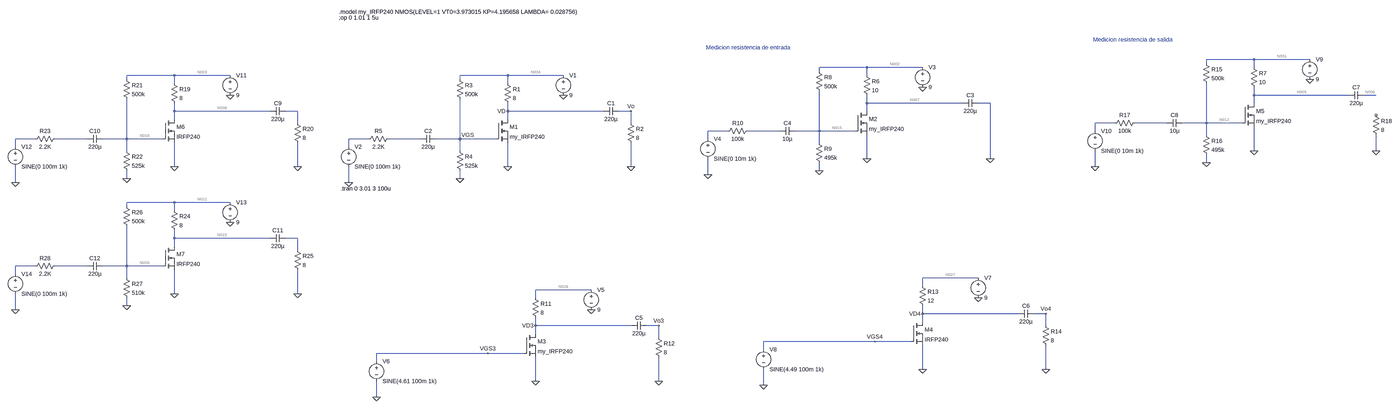
[diagram p0: schematic pruebas_amps.asc, whole sheet]
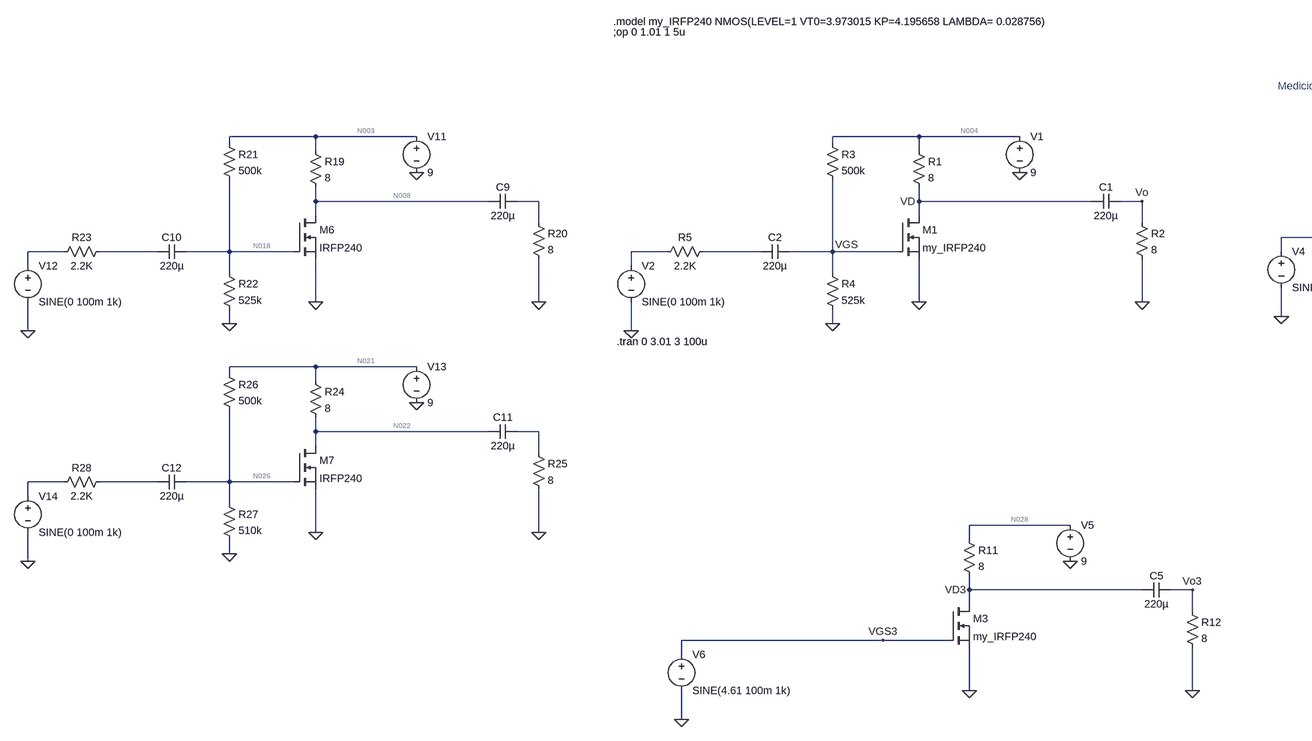
[diagram p1: schematic pruebas_amps.asc, part, row 1 of 1, column 1 of 2]
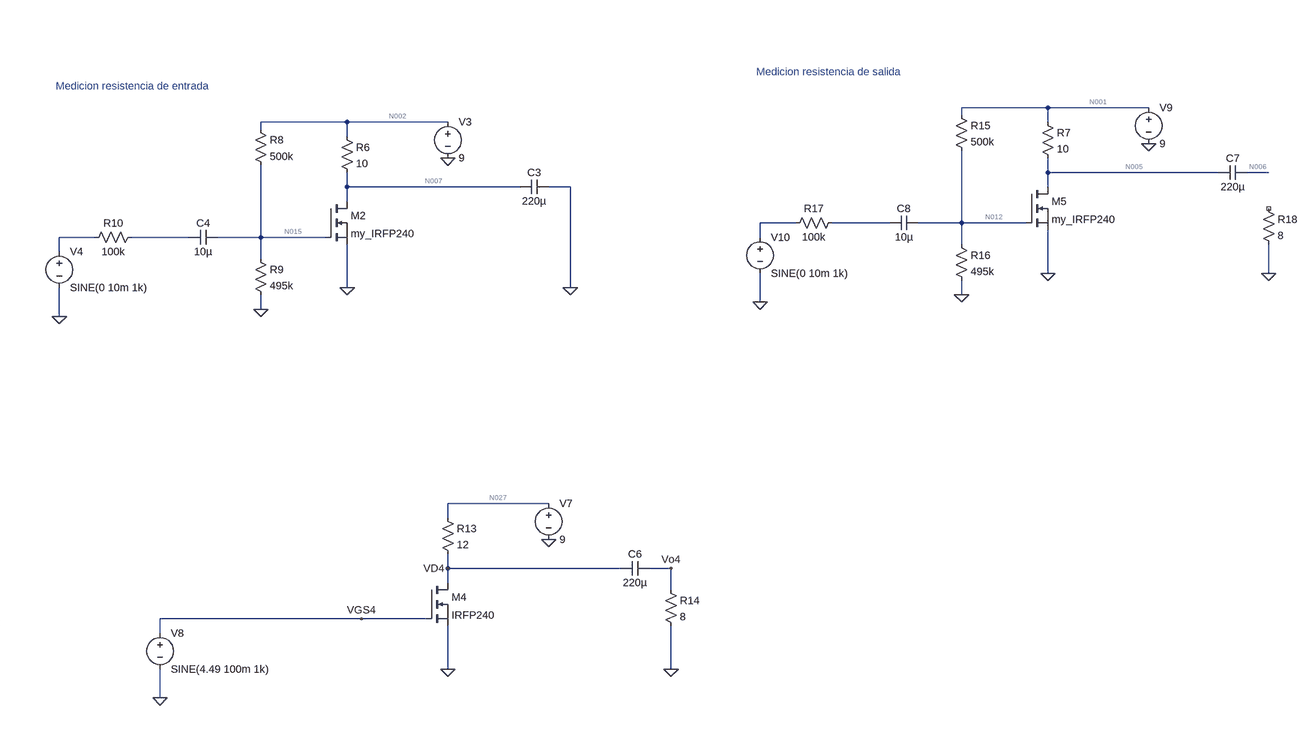
[diagram p2: schematic pruebas_amps.asc, part, row 1 of 1, column 2 of 2]
pruebas_amps.asc, the LTspice schematic file:
Version 4
SHEET 1 4004 1320
WIRE 3440 -128 3248 -128
WIRE 3664 -128 3440 -128
WIRE 3248 -112 3248 -128
WIRE 1712 -96 1520 -96
WIRE 1936 -96 1712 -96
WIRE 3440 -96 3440 -128
WIRE 1520 -80 1520 -96
WIRE -1440 -64 -1632 -64
WIRE -1216 -64 -1440 -64
WIRE 208 -64 16 -64
WIRE 432 -64 208 -64
WIRE 1712 -64 1712 -96
WIRE -1632 -48 -1632 -64
WIRE 16 -48 16 -64
WIRE -1440 -32 -1440 -64
WIRE 208 -32 208 -64
WIRE 3440 16 3440 -16
WIRE 3824 16 3440 16
WIRE 3936 16 3888 16
WIRE 1712 48 1712 16
WIRE 2096 48 1712 48
WIRE 2208 48 2160 48
WIRE 3440 48 3440 16
WIRE -1440 80 -1440 48
WIRE -1056 80 -1440 80
WIRE -944 80 -992 80
WIRE 208 80 208 48
WIRE 592 80 208 80
WIRE 704 80 656 80
WIRE 1712 80 1712 48
WIRE -1440 112 -1440 80
WIRE 208 112 208 80
WIRE -944 128 -944 80
WIRE 704 128 704 80
WIRE 2880 128 2800 128
WIRE 3088 128 2960 128
WIRE 3248 128 3248 -32
WIRE 3248 128 3152 128
WIRE 3392 128 3248 128
WIRE 1152 160 1072 160
WIRE 1360 160 1232 160
WIRE 1520 160 1520 0
WIRE 1520 160 1424 160
WIRE 1664 160 1520 160
WIRE 2800 160 2800 128
WIRE 3248 176 3248 128
WIRE -2000 192 -2080 192
WIRE -1792 192 -1920 192
WIRE -1632 192 -1632 32
WIRE -1632 192 -1728 192
WIRE -1488 192 -1632 192
WIRE -352 192 -432 192
WIRE -144 192 -272 192
WIRE 16 192 16 32
WIRE 16 192 -80 192
WIRE 160 192 16 192
WIRE 1072 192 1072 160
WIRE 1520 208 1520 160
WIRE -2080 224 -2080 192
WIRE -432 224 -432 192
WIRE -1632 240 -1632 192
WIRE 16 240 16 192
WIRE 3440 240 3440 144
WIRE 3936 240 3936 176
WIRE 1712 272 1712 176
WIRE 2208 272 2208 48
WIRE 3248 288 3248 256
WIRE -1440 304 -1440 208
WIRE -944 304 -944 208
WIRE 208 304 208 208
WIRE 704 304 704 208
WIRE 2800 304 2800 240
WIRE 1520 320 1520 288
WIRE 1072 336 1072 272
WIRE -1632 352 -1632 320
WIRE 16 352 16 320
WIRE -2080 368 -2080 304
WIRE -432 368 -432 304
WIRE -1440 448 -1632 448
WIRE -1216 448 -1440 448
WIRE -1632 464 -1632 448
WIRE -1440 480 -1440 448
WIRE -1440 592 -1440 560
WIRE -1056 592 -1440 592
WIRE -944 592 -992 592
WIRE -1440 624 -1440 592
WIRE -944 640 -944 592
WIRE -2000 704 -2080 704
WIRE -1792 704 -1920 704
WIRE -1632 704 -1632 544
WIRE -1632 704 -1728 704
WIRE -1488 704 -1632 704
WIRE -2080 736 -2080 704
WIRE -1632 752 -1632 704
WIRE 2160 752 1936 752
WIRE 1936 784 1936 752
WIRE 544 800 320 800
WIRE -1440 816 -1440 720
WIRE -944 816 -944 720
WIRE 320 832 320 800
WIRE -1632 864 -1632 832
WIRE -2080 880 -2080 816
WIRE 1936 896 1936 864
WIRE 2320 896 1936 896
WIRE 2432 896 2384 896
WIRE 1936 928 1936 896
WIRE 320 944 320 912
WIRE 704 944 320 944
WIRE 816 944 768 944
WIRE 2432 944 2432 896
WIRE 320 976 320 944
WIRE 816 992 816 944
WIRE 1744 1008 1296 1008
WIRE 1888 1008 1744 1008
WIRE 1296 1040 1296 1008
WIRE 128 1056 -320 1056
WIRE 272 1056 128 1056
WIRE -320 1088 -320 1056
WIRE 1936 1120 1936 1024
WIRE 2432 1120 2432 1024
WIRE 320 1168 320 1072
WIRE 816 1168 816 1072
WIRE 1296 1184 1296 1120
WIRE -320 1232 -320 1168
FLAG 208 304 0
FLAG 432 16 0
FLAG 704 304 0
FLAG 16 352 0
FLAG -432 368 0
FLAG 208 80 VD
FLAG 16 192 VGS
FLAG 704 80 Vo
FLAG 320 1168 0
FLAG 816 1168 0
FLAG -320 1232 0
FLAG 320 944 VD3
FLAG 128 1056 VGS3
FLAG 816 944 Vo3
FLAG 544 880 0
FLAG 1936 1120 0
FLAG 2432 1120 0
FLAG 1296 1184 0
FLAG 1936 896 VD4
FLAG 1744 1008 VGS4
FLAG 2432 896 Vo4
FLAG 2160 832 0
FLAG 1712 272 0
FLAG 1936 -16 0
FLAG 2208 272 0
FLAG 1520 320 0
FLAG 1072 336 0
FLAG 3440 240 0
FLAG 3664 -48 0
FLAG 3936 240 0
FLAG 3248 288 0
FLAG 2800 304 0
FLAG -1440 304 0
FLAG -1216 16 0
FLAG -944 304 0
FLAG -1632 352 0
FLAG -2080 368 0
FLAG -1440 816 0
FLAG -1216 528 0
FLAG -944 816 0
FLAG -1632 864 0
FLAG -2080 880 0
SYMBOL nmos 160 112 R0
SYMATTR InstName M1
SYMATTR Value my_IRFP240
SYMBOL voltage 432 -80 R0
WINDOW 123 0 0 Left 0
WINDOW 39 0 0 Left 0
SYMATTR InstName V1
SYMATTR Value 9
SYMBOL res 192 -48 R0
SYMATTR InstName R1
SYMATTR Value 8
SYMBOL cap 656 64 R90
WINDOW 0 0 32 VBottom 2
WINDOW 3 32 32 VTop 2
SYMATTR InstName C1
SYMATTR Value 220µ
SYMBOL res 688 112 R0
SYMATTR InstName R2
SYMATTR Value 8
SYMBOL res 0 -64 R0
SYMATTR InstName R3
SYMATTR Value 500k
SYMBOL res 0 224 R0
SYMATTR InstName R4
SYMATTR Value 525k
SYMBOL cap -80 176 R90
WINDOW 0 0 32 VBottom 2
WINDOW 3 32 32 VTop 2
SYMATTR InstName C2
SYMATTR Value 220µ
SYMBOL res -256 176 R90
WINDOW 0 0 56 VBottom 2
WINDOW 3 32 56 VTop 2
SYMATTR InstName R5
SYMATTR Value 2.2K
SYMBOL voltage -432 208 R0
WINDOW 123 0 0 Left 0
WINDOW 39 0 0 Left 0
SYMATTR InstName V2
SYMATTR Value SINE(0 100m 1k)
SYMBOL nmos 272 976 R0
SYMATTR InstName M3
SYMATTR Value my_IRFP240
SYMBOL voltage 544 784 R0
WINDOW 123 0 0 Left 0
WINDOW 39 0 0 Left 0
SYMATTR InstName V5
SYMATTR Value 9
SYMBOL res 304 816 R0
SYMATTR InstName R11
SYMATTR Value 8
SYMBOL cap 768 928 R90
WINDOW 0 0 32 VBottom 2
WINDOW 3 32 32 VTop 2
SYMATTR InstName C5
SYMATTR Value 220µ
SYMBOL res 800 976 R0
SYMATTR InstName R12
SYMATTR Value 8
SYMBOL voltage -320 1072 R0
WINDOW 123 0 0 Left 0
WINDOW 39 0 0 Left 0
SYMATTR InstName V6
SYMATTR Value SINE(4.61 100m 1k)
SYMBOL nmos 1888 928 R0
SYMATTR InstName M4
SYMATTR Value IRFP240
SYMBOL voltage 2160 736 R0
WINDOW 123 0 0 Left 0
WINDOW 39 0 0 Left 0
SYMATTR InstName V7
SYMATTR Value 9
SYMBOL res 1920 768 R0
SYMATTR InstName R13
SYMATTR Value 12
SYMBOL cap 2384 880 R90
WINDOW 0 0 32 VBottom 2
WINDOW 3 32 32 VTop 2
SYMATTR InstName C6
SYMATTR Value 220µ
SYMBOL res 2416 928 R0
SYMATTR InstName R14
SYMATTR Value 8
SYMBOL voltage 1296 1024 R0
WINDOW 123 0 0 Left 0
WINDOW 39 0 0 Left 0
SYMATTR InstName V8
SYMATTR Value SINE(4.49 100m 1k)
SYMBOL nmos 1664 80 R0
SYMATTR InstName M2
SYMATTR Value my_IRFP240
SYMBOL voltage 1936 -112 R0
WINDOW 123 0 0 Left 0
WINDOW 39 0 0 Left 0
SYMATTR InstName V3
SYMATTR Value 9
SYMBOL res 1696 -80 R0
SYMATTR InstName R6
SYMATTR Value 10
SYMBOL cap 2160 32 R90
WINDOW 0 0 32 VBottom 2
WINDOW 3 32 32 VTop 2
SYMATTR InstName C3
SYMATTR Value 220µ
SYMBOL res 1504 -96 R0
SYMATTR InstName R8
SYMATTR Value 500k
SYMBOL res 1504 192 R0
SYMATTR InstName R9
SYMATTR Value 495k
SYMBOL cap 1424 144 R90
WINDOW 0 0 32 VBottom 2
WINDOW 3 32 32 VTop 2
SYMATTR InstName C4
SYMATTR Value 10µ
SYMBOL res 1248 144 R90
WINDOW 0 0 56 VBottom 2
WINDOW 3 32 56 VTop 2
SYMATTR InstName R10
SYMATTR Value 100k
SYMBOL voltage 1072 176 R0
WINDOW 123 0 0 Left 0
WINDOW 39 0 0 Left 0
SYMATTR InstName V4
SYMATTR Value SINE(0 10m 1k)
SYMBOL nmos 3392 48 R0
SYMATTR InstName M5
SYMATTR Value my_IRFP240
SYMBOL voltage 3664 -144 R0
WINDOW 123 0 0 Left 0
WINDOW 39 0 0 Left 0
SYMATTR InstName V9
SYMATTR Value 9
SYMBOL res 3424 -112 R0
SYMATTR InstName R7
SYMATTR Value 10
SYMBOL cap 3888 0 R90
WINDOW 0 0 32 VBottom 2
WINDOW 3 32 32 VTop 2
SYMATTR InstName C7
SYMATTR Value 220µ
SYMBOL res 3232 -128 R0
SYMATTR InstName R15
SYMATTR Value 500k
SYMBOL res 3232 160 R0
SYMATTR InstName R16
SYMATTR Value 495k
SYMBOL cap 3152 112 R90
WINDOW 0 0 32 VBottom 2
WINDOW 3 32 32 VTop 2
SYMATTR InstName C8
SYMATTR Value 10µ
SYMBOL res 2976 112 R90
WINDOW 0 0 56 VBottom 2
WINDOW 3 32 56 VTop 2
SYMATTR InstName R17
SYMATTR Value 100k
SYMBOL voltage 2800 144 R0
WINDOW 123 0 0 Left 0
WINDOW 39 0 0 Left 0
SYMATTR InstName V10
SYMATTR Value SINE(0 10m 1k)
SYMBOL res 3920 80 R0
SYMATTR InstName R18
SYMATTR Value 8
SYMBOL nmos -1488 112 R0
SYMATTR InstName M6
SYMATTR Value IRFP240
SYMBOL voltage -1216 -80 R0
WINDOW 123 0 0 Left 0
WINDOW 39 0 0 Left 0
SYMATTR InstName V11
SYMATTR Value 9
SYMBOL res -1456 -48 R0
SYMATTR InstName R19
SYMATTR Value 8
SYMBOL cap -992 64 R90
WINDOW 0 0 32 VBottom 2
WINDOW 3 32 32 VTop 2
SYMATTR InstName C9
SYMATTR Value 220µ
SYMBOL res -960 112 R0
SYMATTR InstName R20
SYMATTR Value 8
SYMBOL res -1648 -64 R0
SYMATTR InstName R21
SYMATTR Value 500k
SYMBOL res -1648 224 R0
SYMATTR InstName R22
SYMATTR Value 525k
SYMBOL cap -1728 176 R90
WINDOW 0 0 32 VBottom 2
WINDOW 3 32 32 VTop 2
SYMATTR InstName C10
SYMATTR Value 220µ
SYMBOL res -1904 176 R90
WINDOW 0 0 56 VBottom 2
WINDOW 3 32 56 VTop 2
SYMATTR InstName R23
SYMATTR Value 2.2K
SYMBOL voltage -2080 208 R0
WINDOW 123 0 0 Left 0
WINDOW 39 0 0 Left 0
SYMATTR InstName V12
SYMATTR Value SINE(0 100m 1k)
SYMBOL nmos -1488 624 R0
SYMATTR InstName M7
SYMATTR Value IRFP240
SYMBOL voltage -1216 432 R0
WINDOW 123 0 0 Left 0
WINDOW 39 0 0 Left 0
SYMATTR InstName V13
SYMATTR Value 9
SYMBOL res -1456 464 R0
SYMATTR InstName R24
SYMATTR Value 8
SYMBOL cap -992 576 R90
WINDOW 0 0 32 VBottom 2
WINDOW 3 32 32 VTop 2
SYMATTR InstName C11
SYMATTR Value 220µ
SYMBOL res -960 624 R0
SYMATTR InstName R25
SYMATTR Value 8
SYMBOL res -1648 448 R0
SYMATTR InstName R26
SYMATTR Value 500k
SYMBOL res -1648 736 R0
SYMATTR InstName R27
SYMATTR Value 510k
SYMBOL cap -1728 688 R90
WINDOW 0 0 32 VBottom 2
WINDOW 3 32 32 VTop 2
SYMATTR InstName C12
SYMATTR Value 220µ
SYMBOL res -1904 688 R90
WINDOW 0 0 56 VBottom 2
WINDOW 3 32 56 VTop 2
SYMATTR InstName R28
SYMATTR Value 2.2K
SYMBOL voltage -2080 720 R0
WINDOW 123 0 0 Left 0
WINDOW 39 0 0 Left 0
SYMATTR InstName V14
SYMATTR Value SINE(0 100m 1k)
TEXT -464 392 Left 2 !.tran 0 3.01 3 100u
TEXT -472 -320 Left 2 !.model my_IRFP240 NMOS(LEVEL=1 VT0=3.973015 KP=4.195658 LAMBDA= 0.028756)
TEXT -472 -296 Left 2 !;op 0 1.01 1 5u
TEXT 1064 -176 Left 2 ;Medicion resistencia de entrada
TEXT 2792 -208 Left 2 ;Medicion resistencia de salida

The netlist it stands for:
* pruebas_amps.asc
M1 VD VGS 0 0 my_IRFP240
V1 N004 0 9
R1 N004 VD 8
C1 Vo VD 220µ
R2 Vo 0 8
R3 N004 VGS 500k
R4 VGS 0 525k
C2 VGS N020 220µ
R5 N020 N019 2.2K
V2 N019 0 SINE(0 100m 1k)
M3 VD3 VGS3 0 0 my_IRFP240
V5 N028 0 9
R11 N028 VD3 8
C5 Vo3 VD3 220µ
R12 Vo3 0 8
V6 VGS3 0 SINE(4.61 100m 1k)
M4 VD4 VGS4 0 0 IRFP240
V7 N027 0 9
R13 N027 VD4 12
C6 Vo4 VD4 220µ
R14 Vo4 0 8
V8 VGS4 0 SINE(4.49 100m 1k)
M2 N007 N015 0 0 my_IRFP240
V3 N002 0 9
R6 N002 N007 10
C3 0 N007 220µ
R8 N002 N015 500k
R9 N015 0 495k
C4 N015 N014 10µ
R10 N014 N013 100k
V4 N013 0 SINE(0 10m 1k)
M5 N005 N012 0 0 my_IRFP240
V9 N001 0 9
R7 N001 N005 10
C7 N006 N005 220µ
R15 N001 N012 500k
R16 N012 0 495k
C8 N012 N011 10µ
R17 N011 N010 100k
V10 N010 0 SINE(0 10m 1k)
R18 NC_01 0 8
M6 N008 N018 0 0 IRFP240
V11 N003 0 9
R19 N003 N008 8
C9 N009 N008 220µ
R20 N009 0 8
R21 N003 N018 500k
R22 N018 0 525k
C10 N018 N017 220µ
R23 N017 N016 2.2K
V12 N016 0 SINE(0 100m 1k)
M7 N022 N026 0 0 IRFP240
V13 N021 0 9
R24 N021 N022 8
C11 N023 N022 220µ
R25 N023 0 8
R26 N021 N026 500k
R27 N026 0 510k
C12 N026 N025 220µ
R28 N025 N024 2.2K
V14 N024 0 SINE(0 100m 1k)
.model NMOS NMOS
.model PMOS PMOS
.lib standard.mos
.tran 0 3.01 3 100u
.model my_IRFP240 NMOS(LEVEL=1 VT0=3.973015 KP=4.195658 LAMBDA= 0.028756)
;op 0 1.01 1 5u
* Medicion resistencia de entrada
* Medicion resistencia de salida
.backanno
.end

* Results of the author's LTspice run, read from the files saved beside the schematic
* Operating Point, zero values left out:
*   V(vd) = 1.836 V
*   V(vgs) = 4.61 V
*   V(n004) = 9 V
*   V(vd3) = 1.832 V
*   V(vgs3) = 4.61 V
*   V(n028) = 9 V
*   V(vd4) = 1.857 V
*   V(vgs4) = 4.49 V
*   V(n027) = 9 V
*   V(n007) = 3.176 V
*   V(n015) = 4.477 V
*   V(n002) = 9 V
*   V(n005) = 3.176 V
*   V(n012) = 4.477 V
*   V(n001) = 9 V
*   V(n006) = 698.6 µV
*   V(n008) = 1.746 V
*   V(n018) = 4.61 V
*   V(n003) = 9 V
*   V(n022) = 2.979 V
*   V(n026) = 4.545 V
*   V(n021) = 9 V
*   Id(M1) = 895.5 mA
*   Ib(M1) = -1.846 pA
*   Is(M1) = -895.5 mA
*   Id(M3) = 896 mA
*   Ib(M3) = -1.842 pA
*   Is(M3) = -896 mA
*   Id(M2) = 582.4 mA
*   Ib(M2) = -3.186 pA
*   Is(M2) = -582.4 mA
*   Id(M5) = 582.4 mA
*   Ib(M5) = -3.186 pA
*   Is(M5) = -582.4 mA
*   Id(M4) = 595.3 mA
*   Is(M4) = -595.3 mA
*   Id(M6) = 906.7 mA
*   Is(M6) = -906.7 mA
*   Id(M7) = 752.6 mA
*   Is(M7) = -752.6 mA
*   I(R1) = 895.5 mA
*   I(R3) = 8.78 µA
*   I(R4) = 8.78 µA
*   I(R11) = 896 mA
*   I(R13) = 595.3 mA
*   I(R6) = 582.4 mA
*   I(R8) = 9.045 µA
*   I(R9) = 9.045 µA
*   I(R7) = 582.4 mA
*   I(R15) = 9.045 µA
*   I(R16) = 9.045 µA
*   I(R19) = 906.7 mA
*   I(R21) = 8.78 µA
*   I(R22) = 8.78 µA
*   I(R24) = 752.6 mA
*   I(R26) = 8.911 µA
*   I(R27) = 8.911 µA
*   I(V1) = -895.5 mA
*   I(V5) = -896 mA
*   I(V7) = -595.3 mA
*   I(V3) = -582.4 mA
*   I(V9) = -582.4 mA
*   I(V11) = -906.7 mA
*   I(V13) = -752.6 mA
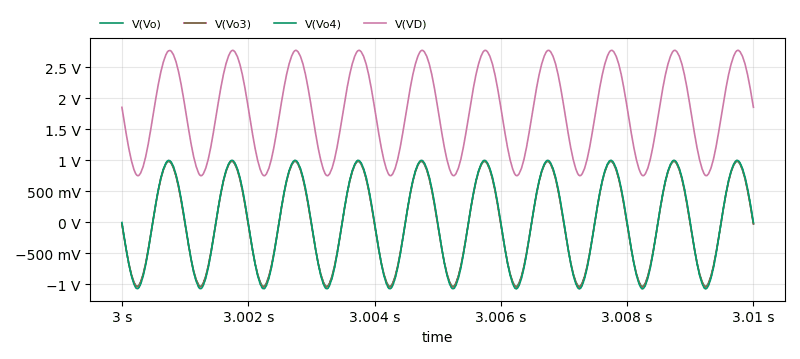
[diagram p3: Transient Analysis of pruebas_amps.asc, plotted from the saved traces]
* Transient Analysis, 1 run:
*   V(Vo): min -1.033 V, max 982.8 mV, average 163.6 µV, rms 708.6 mV, last -24.07 mV
*   V(Vo3): min -1.042 V, max 991.2 mV, average 164.6 µV, rms 714.8 mV, last -24.08 mV
*   V(Vo4): min -1.072 V, max 1.001 V, average 217.5 µV, rms 729.1 mV, last -4.366 mV
*   V(VD): min 752.2 mV, max 2.775 V, average 1.789 V, rms 1.925 V, last 1.857 V